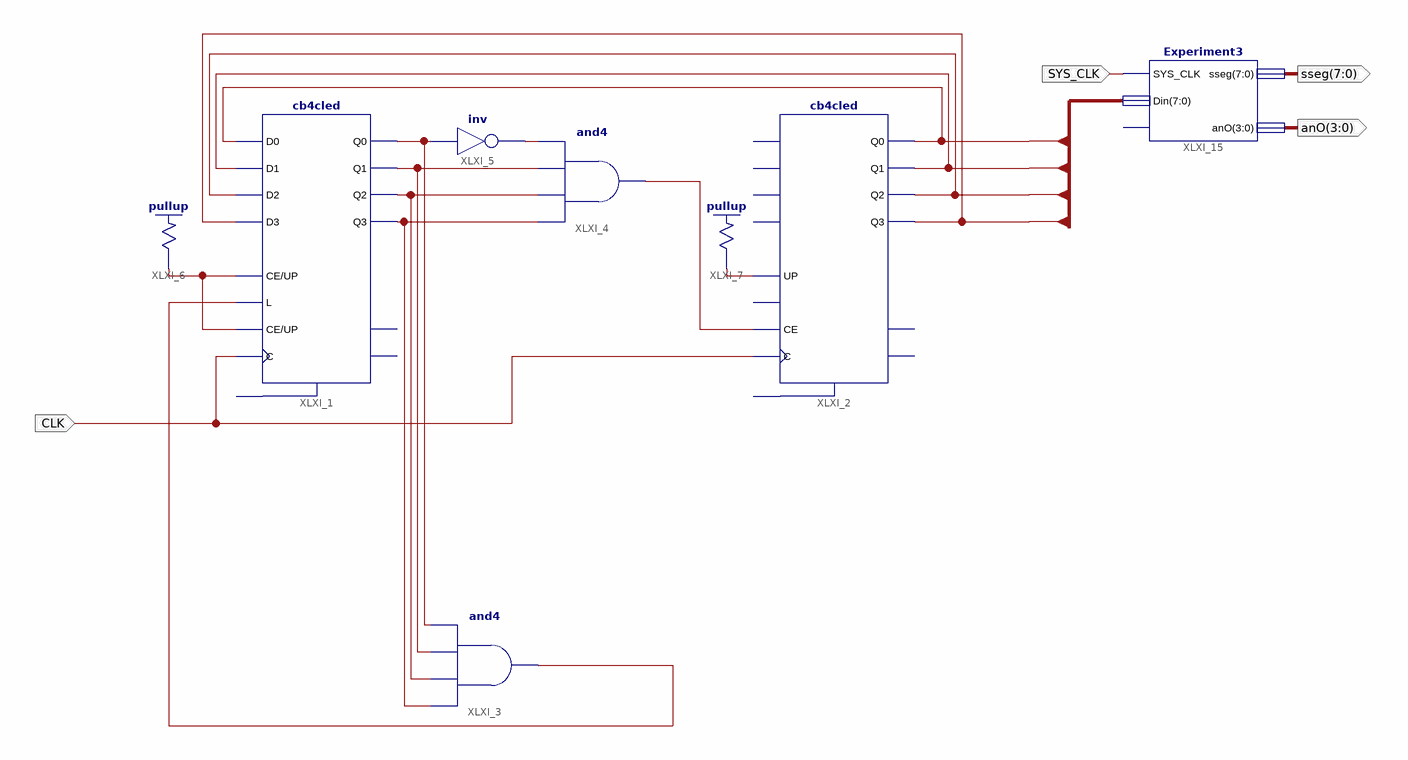
[diagram p0: schematic sheet 1]
// Xilinx ISE schematic EXperiment8_V2.sch (spartan3e) as structural Verilog: 8 symbols, 4 ports
module EXperiment8_V2 (
  input  CLK,
  input  SYS_CLK,
  output [7:0] sseg,
  output [3:0] anO
);

  wire XLXN_7, XLXN_8, XLXN_9, XLXN_10, XLXN_26, XLXN_27, XLXN_30, XLXN_31, XLXN_32;
  wire [7:0] Din;

  cb4cled XLXI_1 (
    .C(CLK), .CE(XLXN_31), .D0(Din[0]), .D1(Din[1]), .D2(Din[2]), .D3(Din[3]), .L(XLXN_27), .UP(XLXN_31),
    .Q0(XLXN_10), .Q1(XLXN_9), .Q2(XLXN_8), .Q3(XLXN_7));  // open: CLR, CEO, TC
  and XLXI_3 (XLXN_27, XLXN_7, XLXN_8, XLXN_9, XLXN_10);
  cb4cled XLXI_2 (
    .C(CLK), .CE(XLXN_30), .UP(XLXN_32), .Q0(Din[0]), .Q1(Din[1]), .Q2(Din[2]), .Q3(Din[3]));  // open: CLR, D0, D1, D2, D3, L, CEO, TC
  and XLXI_4 (XLXN_30, XLXN_7, XLXN_8, XLXN_9, XLXN_26);
  not XLXI_5 (XLXN_26, XLXN_10);
  \pullup  XLXI_7 (.O(XLXN_32));
  \pullup  XLXI_6 (.O(XLXN_31));
  Experiment3 XLXI_15 (.SYS_CLK(SYS_CLK), .Din(Din), .sseg(sseg), .anO(anO));  // open: En
endmodule
